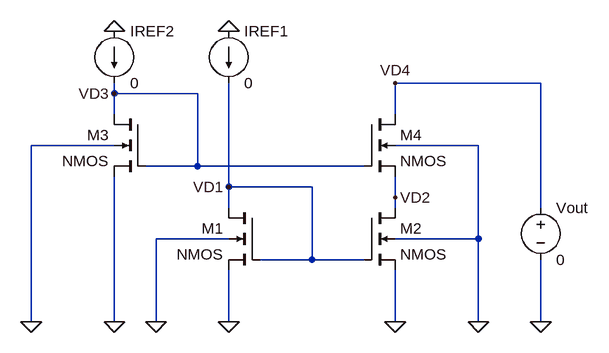
[diagram p0: schematic Chapter03D_03.fig.asc]
Chapter03D_03.fig.asc, the LTspice schematic file:
Version 4
SHEET 1 2940 740
WIRE 256 -144 32 -144
WIRE -400 -128 -400 -144
WIRE -272 -128 -400 -128
WIRE -400 -96 -400 -128
WIRE 32 -96 32 -144
WIRE -400 -48 -528 -48
WIRE 160 -48 32 -48
WIRE -272 -16 -272 -128
WIRE -272 -16 -352 -16
WIRE -16 -16 -272 -16
WIRE -224 16 -224 -144
WIRE -96 16 -224 16
WIRE 32 32 32 0
WIRE -224 48 -224 16
WIRE 32 48 32 32
WIRE 256 48 256 -144
WIRE -224 96 -336 96
WIRE 160 96 160 -48
WIRE 160 96 32 96
WIRE -96 128 -96 16
WIRE -96 128 -176 128
WIRE -16 128 -96 128
WIRE -528 224 -528 -48
WIRE -400 224 -400 0
WIRE -336 224 -336 96
WIRE -224 224 -224 144
WIRE 32 224 32 144
WIRE 160 224 160 96
WIRE 256 224 256 128
FLAG -224 224 0
FLAG -336 224 0
FLAG 32 224 0
FLAG 160 224 0
FLAG 256 224 0
FLAG -224 -224 0
FLAG 32 -144 VD4
FLAG -528 224 0
FLAG -400 224 0
FLAG -400 -224 0
FLAG 32 32 VD2
FLAG -224 16 VD1
FLAG -400 -128 VD3
SYMBOL nmos4 -176 48 M0
SYMATTR InstName M1
SYMBOL nmos4 -16 48 R0
SYMATTR InstName M2
SYMBOL voltage 256 32 R0
SYMATTR InstName Vout
SYMATTR Value 0
SYMBOL current -224 -224 R0
WINDOW 123 0 0 Left 0
WINDOW 39 0 0 Left 0
SYMATTR InstName IREF1
SYMATTR Value 0
SYMBOL nmos4 -352 -96 M0
SYMATTR InstName M3
SYMBOL nmos4 -16 -96 R0
SYMATTR InstName M4
SYMBOL current -400 -224 R0
WINDOW 123 0 0 Left 0
WINDOW 39 0 0 Left 0
SYMATTR InstName IREF2
SYMATTR Value 0

The netlist it stands for:
* Chapter03D_03.fig.asc
M1 VD1 VD1 0 0 NMOS
M2 VD2 VD1 0 0 NMOS
Vout VD4 0 0
IREF1 0 VD1 0
M3 VD3 VD3 0 0 NMOS
M4 VD4 VD3 VD2 0 NMOS
IREF2 0 VD3 0
.model NMOS NMOS
.model PMOS PMOS
.lib standard.mos
.backanno
.end